# Altium schematic sheet HeadSheet.SchDoc
size Letter; SheetNumber: 1; SheetTotal: 5
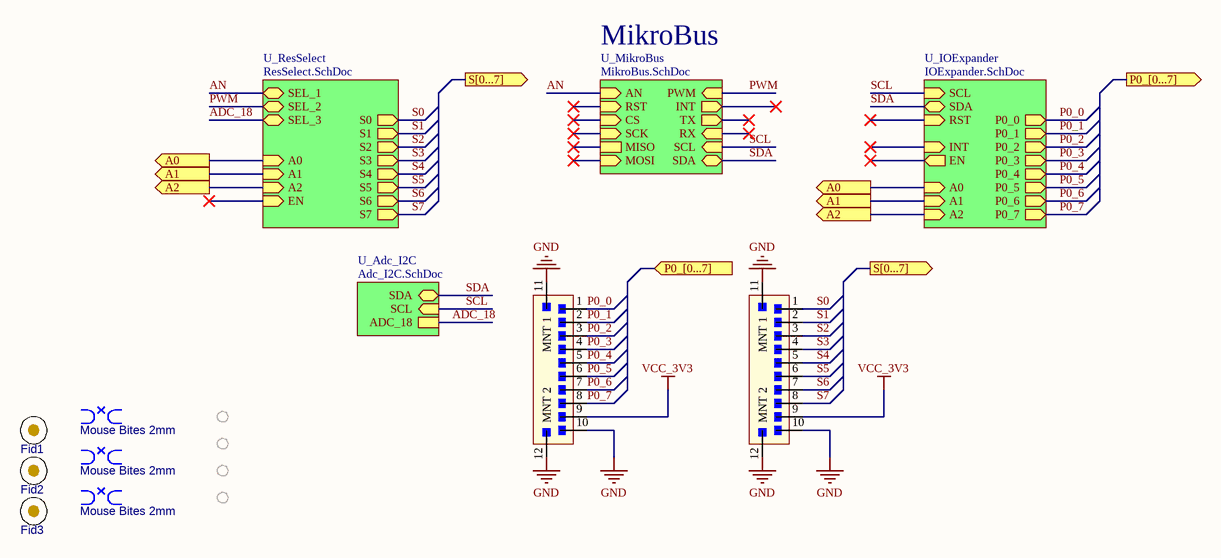
[diagram p0: HeadSheet.SchDoc]

## Parts
BRK1  value Mouse Bites 2mm  [BK_CRACK1B_M]  (hidden comment: DNP)  (no BOM)
BRK2  value Mouse Bites 2mm  [BK_CRACK1B_M]  (hidden comment: DNP)  (no BOM)
BRK3  value Mouse Bites 2mm  [BK_CRACK1B_M]  (hidden comment: DNP)  (no BOM)
Fid1  DNP  [FD_Fiducial]  (value not drawn)  (no BOM)
Fid2  DNP  [FD_Fiducial]  (value not drawn)  (no BOM)
Fid3  DNP  [FD_Fiducial]  (value not drawn)  (no BOM)
J1  HC-ZH-10PWT  [J_S10B-ZR-SM4]  (value not drawn)
J2  HC-ZH-10PWT  [J_S10B-ZR-SM4]  (value not drawn)
MH1  DNP  [MP_M-Hole_M2-NonPlated]  (value not drawn)  (no BOM)
MH2  DNP  [MP_M-Hole_M2-NonPlated]  (value not drawn)  (no BOM)
MH3  DNP  [MP_M-Hole_M2-NonPlated]  (value not drawn)  (no BOM)
MH4  DNP  [MP_M-Hole_M2-NonPlated]  (value not drawn)  (no BOM)

## Sub-sheets
U_Adc_I2C = Adc_I2C.SchDoc: ADC_18, SCL (in), SDA (bidir)
U_IOExpander = IOExpander.SchDoc: SCL (in), SDA (bidir), RST (in), P0_0 (out), P0_1 (out), P0_2 (out), P0_3 (out), P0_4 (out), P0_5 (out), P0_6 (out), P0_7 (out), EN (out), INT (in), A0 (in), A1 (in), A2 (in)
U_MikroBus = MikroBus.SchDoc: SDA (bidir), SCL (in), RX (in), TX (out), INT (out), PWM (in), MOSI (in), MISO, SCK (in), CS (in), RST (in), AN (in)
U_ResSelect = ResSelect.SchDoc: EN (in), S0 (out), S1 (out), S2 (out), S3 (out), S4 (out), S5 (out), S6 (out), S7 (out), SEL_1 (bidir), SEL_2 (bidir), SEL_3 (bidir), A0 (in), A1 (in), A2 (in)

## Ports
A0 (out), A1 (out), A2 (out), P0_[0...7] (in), P0_[0...7] (out), S[0...7] (out)

## Nets
GND: J1.10 J1.11(MNT_1) J1.12(MNT_2) J2.10 J2.11(MNT_1) J2.12(MNT_2)
VCC_3V3: J1.9 J2.9
A0: port A0, sheet U_IOExpander/A0, sheet U_ResSelect/A0
A1: port A1, sheet U_IOExpander/A1, sheet U_ResSelect/A1
A2: port A2, sheet U_IOExpander/A2, sheet U_ResSelect/A2
ADC_18: sheet U_Adc_I2C/ADC_18, sheet U_ResSelect/SEL_3
AN: sheet U_MikroBus/AN, sheet U_ResSelect/SEL_1
P0_0: J1.1 ; sheet U_IOExpander/P0_0
P0_1: J1.2 ; sheet U_IOExpander/P0_1
P0_2: J1.3 ; sheet U_IOExpander/P0_2
P0_3: J1.4 ; sheet U_IOExpander/P0_3
P0_4: J1.5 ; sheet U_IOExpander/P0_4
P0_5: J1.6 ; sheet U_IOExpander/P0_5
P0_6: J1.7 ; sheet U_IOExpander/P0_6
P0_7: J1.8 ; sheet U_IOExpander/P0_7
PWM: sheet U_MikroBus/PWM, sheet U_ResSelect/SEL_2
S0: J2.1 ; sheet U_ResSelect/S0
S1: J2.2 ; sheet U_ResSelect/S1
S2: J2.3 ; sheet U_ResSelect/S2
S3: J2.4 ; sheet U_ResSelect/S3
S4: J2.5 ; sheet U_ResSelect/S4
S5: J2.6 ; sheet U_ResSelect/S5
S6: J2.7 ; sheet U_ResSelect/S6
S7: J2.8 ; sheet U_ResSelect/S7
SCL: sheet U_MikroBus/SCL, sheet U_Adc_I2C/SCL, sheet U_IOExpander/SCL
SDA: sheet U_MikroBus/SDA, sheet U_Adc_I2C/SDA, sheet U_IOExpander/SDA

Not connected (* = marked no-connect by the designer): BRK1 1 2 3 4 5; BRK2 1 2 3 4 5; BRK3 1 2 3 4 5; Fid1 1 2 3 4 5; Fid2 1 2 3 4 5; Fid3 1 2 3 4 5

## Notes on the sheet
- MikroBus
- Titre :
- Conception :
- Date :
- Approbation :
- Heure :
- Révision :
- Feuille
- de
- Fichier :

## Library data of the parts
BRK1-BRK3 = BK_BREAKOUT_2MM: Mouse Bites; Mounting Technology: N/A
Fid1-Fid3 = Fiducial: Fiducial mark for alignement and Pick&Place; Value: Fiducial mark; Mounting Technology: N/A
J1 J2 = CONN-1MM5-01X10-S10B-H-SMT: CONN wire to board SMT R/A 10POS 1.5mm; Manufacturer 1: HCTL; Manufacturer Part Number 1: HC-ZH-10PWT; Manufacturer 2: JST; Manufacturer Part Number 2: S10B-ZR-SM4A-TF(LF)(SN); Mounting Technology: SMT; Supplier 1: LCSC; Supplier 2: LCSC; Supplier Part Number 1: C2845432; Supplier Part Number 2: C5149249; Supplier 3: Digikey; Supplier Part Number 3: 455-1700-1-ND
MH1-MH4 = MH-2MM_NP: Mounting Hole 2mm non plated; Manufacturer Part Number 1: DNP; Mounting Technology: N/A; Value: Mounting Hole 2mm non plated; Supplier Part Number 1: N/A